# EAGLE schematic Adapter-robot (EAGLE 7.2.0)
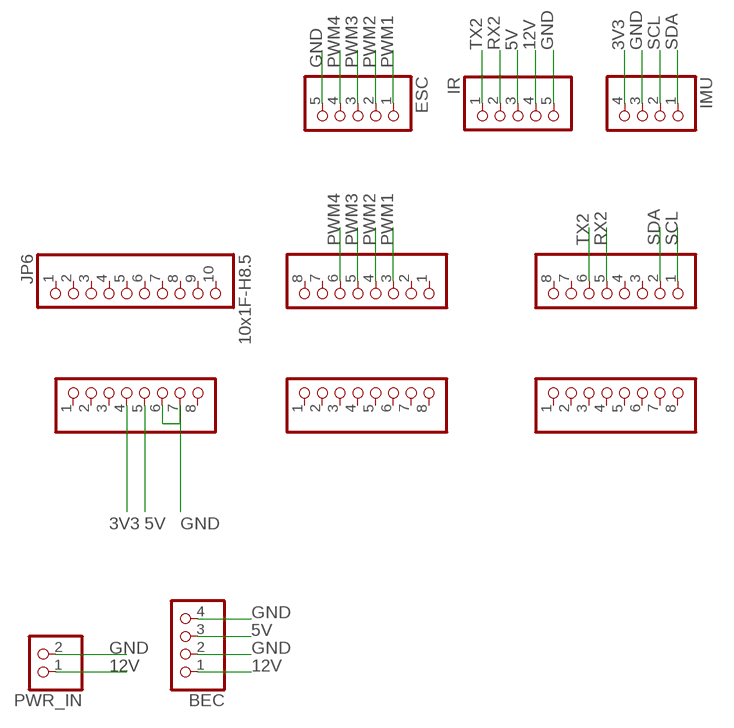
[diagram p0: schematic, sheet 1]

## Parts
ADCH  8x1F-H8.5  PINHD-1X8  [1X08]
ADCL  8x1F-H8.5  PINHD-1X8  [1X08]
BEC  PINHD-1X4  [1X04]
COMMUNICATION  8x1F-H8.5  PINHD-1X8  [1X08]
ESC  PINHD-1X5  [1X05]
IMU  PINHD-1X4  [1X04]
IR  PINHD-1X5  [1X05]
JP6  10x1F-H8.5  PINHD-1X10_ARD  [1X10]
POWER  8x1F-H8.5  PINHD-1X8  [1X08]
PWML  8x1F-H8.5  PINHD-1X8  [1X08]
PWR_IN  PINHD-1X2  [1X02]

## Nets
3V3: IMU.4 POWER.4
5V: BEC.3 IR.3 POWER.5
12V: BEC.1 IR.4 PWR_IN.1
GND: BEC.2 BEC.4 ESC.5 IMU.3 IR.5 POWER.6 POWER.7 PWR_IN.2
PWM1: ESC.1 PWML.3
PWM2: ESC.2 PWML.4
PWM3: ESC.3 PWML.5
PWM4: ESC.4 PWML.6
RX2: COMMUNICATION.5 IR.2
SCL: COMMUNICATION.1 IMU.2
SDA: COMMUNICATION.2 IMU.1
TX2: COMMUNICATION.6 IR.1
Unconnected: ADCH.1 ADCH.2 ADCH.3 ADCH.4 ADCH.5 ADCH.6 ADCH.7 ADCH.8 ADCL.1 ADCL.2 ADCL.3 ADCL.4 ADCL.5 ADCL.6 ADCL.7 ADCL.8 COMMUNICATION.3 COMMUNICATION.4 COMMUNICATION.7 COMMUNICATION.8 JP6.1 JP6.2 JP6.3 JP6.4 JP6.5 JP6.6 JP6.7 JP6.8 JP6.9 JP6.10 POWER.1 POWER.2 POWER.3 POWER.8 PWML.1 PWML.2 PWML.7 PWML.8

## Library data of the parts
ADCH ADCL COMMUNICATION POWER PWML = SmartPrj:PINHD-1X8: PIN HEADER
BEC IMU = pinhead:PINHD-1X4: PIN HEADER
ESC IR = pinhead:PINHD-1X5: PIN HEADER
JP6 = SmartPrj:PINHD-1X10_ARD: PIN HEADER
PWR_IN = pinhead:PINHD-1X2: PIN HEADER

## Net classes
0 default: width 0.203 mm, drill 0.406 mm, clearance 0.203 mm
1 power: width 0.61 mm, drill 0.406 mm, clearance 0.203 mm
2 gnd: width 0.305 mm, drill 0.406 mm, clearance 0.203 mm
3 power usb: width 0.508 mm, drill 0.406 mm, clearance 0.203 mm